# Altium schematic sheet ETH_IFC.SchDoc: Ethernet Interface
size 420 x 297 mm; Author: G.K.; CompanyName: WUT; DrawnBy: G.K.; Organization: WUT ISE; Address1: Warsaw Univeristy of Technology; Address2: Nowowiejska 15/19; DocumentNumber: 2; SheetNumber: 2; SheetTotal: 3; EDA_Number: Sinara; Projet: Booster RF Power Amplifier; ModifiedBy: -; CreateDate: XX/XX/XXXX; CheckedDate: -; Title2: MAC + PHY; DivGrp: ISE; Designer: G.K.; ModifiedDate: -; ProjectName: Booster RF Power Amplifier
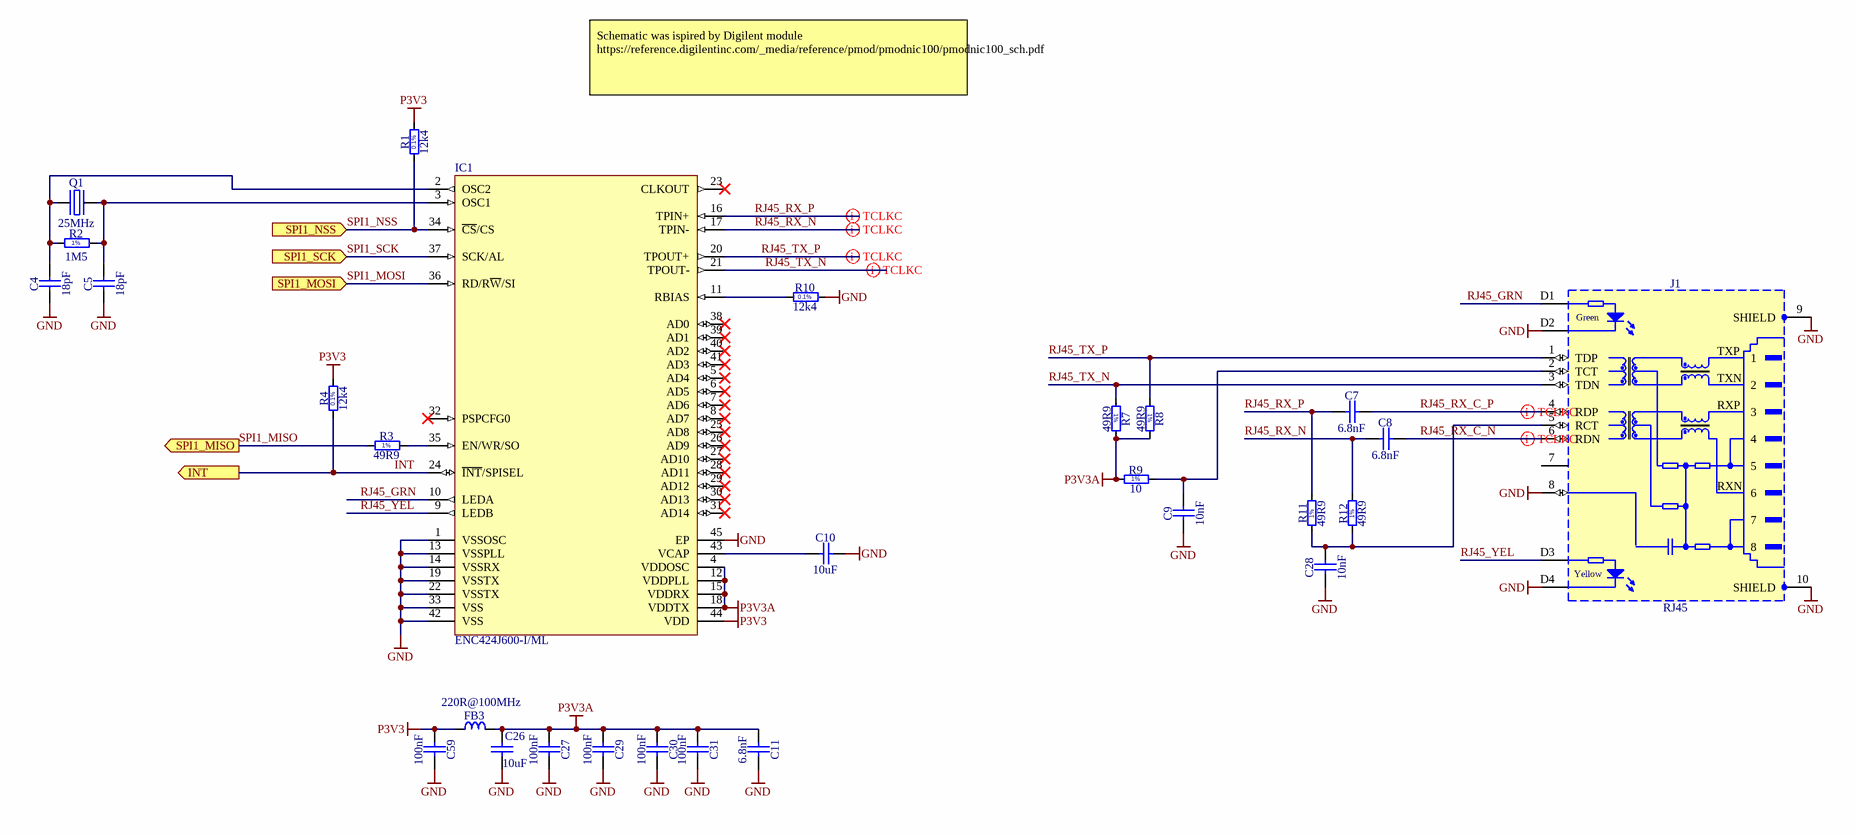
[diagram p0: ETH_IFC.SchDoc]

## Parts
C4  18pF  [CAPC1005X55N]
C5  18pF  [CAPC1005X55N]
C7  6.8nF  [CAPC1608X87N]
C8  6.8nF  [CAPC1608X87N]
C9  10nF  [CAPC1608X87N]
C10  10uF  [CAPC1608X80N]
C11  6.8nF  [CAPC1608X87N]
C26  10uF  [CAPC2012X135N]
C27  100nF  [CAPC1005X55N]
C28  10nF  [CAPC1608X87N]
C29  100nF  [CAPC1005X55N]
C30  100nF  [CAPC1005X55N]
C31  100nF  [CAPC1005X55N]
C59  100nF  [CAPC1005X55N]
FB3  220R@100MHz  [INDC2012X105N]
IC1  ENC424J600-I/ML  [QFN-ML44_M]
J1  RJ45  [TYCO_5-6605308-1]
Q1  25MHz  [XTAL_TXC_AA]
R1  12k4  [RESC1608X55N]
R2  1M5  [RESC1005X40N]
R3  49R9  [RESC1005X40N]
R4  12k4  [RESC1608X55N]
R7  49R9  [RESC1005X40N]
R8  49R9  [RESC1005X40N]
R9  10  [RESC1005X40N]
R10  12k4  [RESC1608X55N]
R11  49R9  [RESC1005X40N]
R12  49R9  [RESC1005X40N]

## Ports
INT (out), SPI1_MISO (out), SPI1_MOSI (in), SPI1_NSS (in), SPI1_SCK (in)

## Nets
GND: C4.1 C5.1 C9.1 C10.2 C11.2 C26.2 C27.2 C28.1 C29.2 C30.2 C31.2 C59.2 IC1.1(VSSOSC) IC1.13(VSSPLL) IC1.14(VSSRX) IC1.19(VSSTX) IC1.22(VSSTX) IC1.33(VSS) IC1.42(VSS) IC1.45(EP) J1.8 J1.9(SHIELD) J1.10(SHIELD) J1.D2 J1.D4 R10.2
P3V3: C59.1 FB3.1 IC1.44(VDD) R1.2 R4.2
P3V3A: C11.1 C26.1 C27.1 C29.1 C30.1 C31.1 FB3.2 IC1.4(VDDOSC) IC1.12(VDDPLL) IC1.15(VDDRX) IC1.18(VDDTX) R7.2 R8.2 R9.1
INT: IC1.24(~{INT}/SPISEL) R4.1 ; port INT
RJ45_GRN: IC1.10(LEDA) J1.D1
RJ45_RX_C_N: C8.2 J1.6(RDN)
RJ45_RX_C_P: C7.2 J1.4(RDP)
RJ45_RX_N: C8.1 IC1.17(TPIN-) R12.2
RJ45_RX_P: C7.1 IC1.16(TPIN+) R11.2
RJ45_TX_N: IC1.21(TPOUT-) J1.3(TDN) R7.1
RJ45_TX_P: IC1.20(TPOUT+) J1.1(TDP) R8.1
RJ45_YEL: IC1.9(LEDB) J1.D3
SPI1_MISO: R3.1 ; port SPI1_MISO
SPI1_MOSI: IC1.36(RD/R~{W}/SI) ; port SPI1_MOSI
SPI1_NSS: IC1.34(~{CS}/CS) R1.1 ; port SPI1_NSS
SPI1_SCK: IC1.37(SCK/AL) ; port SPI1_SCK
NetC4_2: C4.2 IC1.2(OSC2) Q1.1(OSC1) R2.1
NetC5_2: C5.2 IC1.3(OSC1) Q1.2(OSC2) R2.2
NetC9_2: C9.2 J1.2(TCT) R9.2
NetC10_1: C10.1 IC1.43(VCAP)
NetC28_2: C28.2 J1.5(RCT) R11.1 R12.1
NetIC1_11: IC1.11(RBIAS) R10.1
NetIC1_35: IC1.35(EN/WR/SO) R3.2

Not connected (* = marked no-connect by the designer): IC1 5(AD4)* 6(AD5)* 7(AD6)* 8(AD7)* 23(CLKOUT)* 25(AD8)* 26(AD9)* 27(AD10)* 28(AD11)* 29(AD12)* 30(AD13)* 31(AD14)* 32(PSPCFG0)* 38(AD0)* 39(AD1)* 40(AD2)* 41(AD3)*; J1 7

## Layout directives
differential pair: RJ45_RX_C_N, RJ45_RX_C_P, RJ45_RX_N, RJ45_RX_P, RJ45_TX_N, RJ45_TX_P

## Notes on the sheet
- Schematic was ispired by Digilent module https://reference.digilentinc.com/_media/reference/pmod/pmodnic100/pmodnic100_sch.pdf
- Project/Equipment
- Document
- Designer
- Drawn by
- Check.by
- File
- Last Mod.
- Print Date
- Sheet
- Size
- A3
- of
- Rev
- (in symbol R0402_1M5_1%_0.0625W_100PPM) 1%
- (in symbol R0402_10R_1%_0.0625W_200PPM) 1%
- (in symbol R0402_49R9_1%_0.0625W_100PPM) 1%
- (in symbol R0603_12K4_0.1%_0.063W_10PPM) 0.1%
- (in symbol TYCO_5-6605308-1) Green; TXP; TXN; RXP; RXN; Yellow

## Library data of the parts
C4 C5 = CC0402_18PF_50V_5%_C0G: Non-polarised capacitor; Part Description: SMD Multilayer Chip Ceramic Capacitor; Manufacturer: GENERIC; Manufacturer1 Part Number: C0402C180J5GACTU; Voltage: 50V; TC: C0G/NP0; Tolerance: ±5%; Part Number: CC0402_18PF_50V_5%_C0G; Component Kind: Standard; Component Type: Standard; Pin Count: 2; Value: 18pF; Status: Preferred; Manufacturer Part Number: CC0402_18PF_50V_5%_C0G; Case: 0402; Mounted: Yes; Socket: No; SMD: Yes; Manufacturer1 Example: KEMET; Manufacturer1 ComponentHeight: 0.55mm; HelpURL: \\cern.ch\dfs\Applications\Altium\Datasheets\CC0402_C0G_KEMET_(Commercial Grade).pdf; Author: CERN DEM JLC; CreateDate: 04.10.2016; LatestRevisionDate: 04.10.2016; Sense: No
C7 C8 C11 = CC0603_6.8NF_25V_1%_C0G: Non-polarised capacitor; Part Description: SMD Multilayer Chip Ceramic Capacitor; Manufacturer: GENERIC; Manufacturer1 Part Number: C0603C682F3GACTU; Voltage: 25V; TC: C0G/NP0; Tolerance: ±1%; Part Number: CC0603_6.8NF_25V_1%_C0G; Component Kind: Standard; Component Type: Standard; Pin Count: 2; Value: 6.8nF; Status: None; Manufacturer Part Number: CC0603_6.8NF_25V_1%_C0G; Case: 0603; Mounted: Yes; Socket: No; SMD: Yes; Sense: No; Manufacturer1 Example: KEMET; Manufacturer1 ComponentHeight: 0.87mm; HelpURL: \\cern.ch\dfs\Applications\Altium\Datasheets\CC0603_C0G_KEMET_(Commercial Grade).pdf; Author: CERN DEM JLC; CreateDate: 23/05/2018; LatestRevisionDate: 23/05/2018
C9 C28 = CC0603_10NF_50V_5%_C0G: Non-polarised capacitor; Part Description: SMD Multilayer Chip Ceramic Capacitor; Manufacturer: GENERIC; Manufacturer1 Part Number: C1608C0G1H103J080AA; Voltage: 50V; TC: C0G/NP0; Tolerance: ±5%; Part Number: CC0603_10NF_50V_5%_C0G; Component Kind: Standard; Component Type: Standard; Pin Count: 2; Value: 10nF; Status: Preferred; Manufacturer Part Number: CC0603_10NF_50V_5%_C0G; Case: 0603; Mounted: Yes; Socket: No; SMD: Yes; Sense: No; Manufacturer1 Example: TDK; Manufacturer1 ComponentHeight: 0.9mm; HelpURL: \\cern.ch\dfs\Applications\Altium\Datasheets\CC0603_C0G_TDK_C.pdf; Author: CERN DEM JLC; CreateDate: 10.12.2014; LatestRevisionDate: 10.12.2014
C10 = CC0603_10UF_16V_20%_X5R: Non-polarised capacitor; Part Description: SMD Multilayer Chip Ceramic Capacitor; Manufacturer: GENERIC; Manufacturer1 Part Number: GRM188R61C106MA73D; Voltage: 16V; TC: X5R; Tolerance: ±20%; Part Number: CC0603_10UF_16V_20%_X5R; Component Kind: Standard; Component Type: Standard; Pin Count: 2; Value: 10uF; Status: None; Manufacturer Part Number: CC0603_10UF_16V_20%_X5R; Case: 0603; Mounted: Yes; Socket: No; SMD: Yes; Sense: No; Manufacturer1 Example: MURATA; Manufacturer1 ComponentHeight: 0.8mm; HelpURL: \\cern.ch\dfs\Applications\Altium\Datasheets\CC0603_X5R_MURATA_GRM.pdf; Author: CERN DEM MR; CreateDate: 02/03/2016; LatestRevisionDate: 02/03/2016
C26 = CC0805_10UF_10V_10%_X7R: Non-polarised capacitor; Part Description: SMD Multilayer Chip Ceramic Capacitor; Manufacturer: GENERIC; Manufacturer1 Part Number: GRM21BR71A106KE51L; Voltage: 10V; TC: X7R; Tolerance: ±10%; Table: Capacitors SMD; Part Number: CC0805_10UF_10V_10%_X7R; Component Kind: Standard; Component Type: Standard; Pin Count: 2; Value: 10uF; Status: Preferred; Manufacturer Part Number: CC0805_10UF_10V_10%_X7R; Case: 0805; Mounted: Yes; Socket: No; SMD: Yes; Manufacturer1 Example: MURATA; Manufacturer1 ComponentHeight: 1.35mm; HelpURL: \\cern.ch\dfs\Applications\Altium\Datasheets\CC0805_X7R_MURATA.pdf; Author: CERN DEM JLC; CreateDate: 2012-04-30; LatestRevisionDate: 2012-04-30
C27 C29-C31 C59 = CC0402_100NF_16V_10%_X7R: Non-polarised capacitor; Part Description: SMD Multilayer Chip Ceramic Capacitor; Manufacturer: GENERIC; Manufacturer1 Part Number: GRM155R71C104KA88D; Voltage: 16V; TC: X7R; Tolerance: ±10%; Part Number: CC0402_100NF_16V_10%_X7R; Component Kind: Standard; Component Type: Standard; Pin Count: 2; Value: 100nF; Status: Not Recommended; Manufacturer Part Number: CC0402_100NF_16V_10%_X7R; Case: 0402; Mounted: Yes; Socket: No; SMD: Yes; Manufacturer1 Example: MURATA; Manufacturer1 ComponentHeight: 0.55mm; HelpURL: \\cern.ch\dfs\Applications\Altium\Datasheets\CC0402_X7R_MURATA_GRM.pdf; Author: CERN DEM JLC; CreateDate: 05.12.2013; LatestRevisionDate: 03.12.2007; Sense: No
FB3 = IND0805_MURATA_BLM21PG221SN1D: Inductor; Part Description: SMD EMIFIL Suppression Chip Ferrite Bead; Manufacturer: MURATA; Power: 2A; Resistance: 0.05R; Tolerance: ±25%; Table: Inductors SMD; Part Number: IND0805_MURATA_BLM21PG221SN1D; Component Kind: Standard; Component Type: Standard; Pin Count: 2; Value: 220R@100MHz; Status: None; Manufacturer Part Number: BLM21PG221SN1D; Case: 0805; Mounted: Yes; Socket: No; SMD: Yes; ComponentHeight: 1.05mm; HelpURL: \\cern.ch\dfs\Applications\Altium\Datasheets\IND0402_MURATA_BLM21P.pdf; Author: CERN DEM JLC; CreateDate: 2010-01-25; LatestRevisionDate: 2010-01-25
IC1 = CMP-0186-00117-2: Stand-Alone 10/100 Ethernet Controller with SPI or Parallel Interface, 44-Pin QFN, Industrial Temperature; Code_IPC: QFN65P800X800-44V2; ComponentLink2Description: Datasheet; PackageReference: QFN-ML44; ComponentLink2URL: http://ww1.microchip.com/downloads/en/DeviceDoc/39935c.pdf; ComponentLink3URL: http://www.microchip.com/stellent/groups/techpub_sg/documents/packagingspec/en012702.pdf; RevisionNote: URLs added. DatasheetVersion updated. Sch updated.; Code_JEDEC: MO-220; ComponentLink1URL: http://www.microchip.com/; PackageDescription: 44-Lead Plastic Quad Flat, No Lead Package (ML) - 8x8 mm Body [QFN]; ComponentLink1Description: Manufacturer URL; DatasheetVersion: revC, Jan-2010; ComponentLink3Description: Package Specification; PackageVersion: revBB, Aug-2009; Manufacturer Part Number: ENC424J600-I/ML
J1 = TYCO_5-6605308-1: 1 Port, Yellow/Green LEDs, RJ45 10/100Base-T Ethernet, Mag45 Connector Module With Integrated Magnetics; Manufacturer: TYCO ELECTRONICS; PressFit: No; Part Number: TYCO_5-6605308-1; Component Kind: Standard; Component Type: Standard; Pin Count: 14; Family: RJ45; Mounted: Yes; Socket: No; SMD: No; Sense: No; Status: None; Part Description: 1 Port, Yellow/Green LEDs, RJ45 10/100Base-T Ethernet, Mag45 Connector Module With Integrated Magnetics; Manufacturer Part Number: 5-6605308-1; ComponentHeight: 15.24mm; HelpURL: \\cern.ch\dfs\Applications\Altium\Datasheets\TYCO_5-6605308-1.pdf; Author: CERN DEM JLC; CreateDate: 23.08.2012; LatestRevisionDate: 23.08.2012
Q1 = XTAL_25MHZ_TXC_AA-25.000MALE-T: Quartz Crystal; Part Description: Tolerance: ± 30ppm, Stability: ±50ppm, -40°C to +85°C, 8pF, SMD Glass Sealing Crystal, AA Series; Manufacturer: TXC CORPORATION; PressFit: No; Bonding: No; Part Number: XTAL_25MHZ_TXC_AA-25.000MALE-T; Component Kind: Standard; Component Type: Standard; PackageDescription: SMD Glass Seam Sealing Crystal, 2 Pins, 3.20mm L X 5.00mm W, AA Serie; Value: 25MHz; Manufacturer Part Number: AA-25.000MALE-T; Pin Count: 2; Mounted: Yes; Socket: No; SMD: Yes; Sense: No; ComponentHeight: 1.2mm; HelpURL: \\cern.ch\dfs\Applications\Altium\Datasheets\XTAL_TXC_AA.pdf; Author: GK; CreateDate: 28.08.2018; LatestRevisionDate: 28.08.2018
R1 R4 R10 = R0603_12K4_0.1%_0.063W_10PPM: Resistor - 0.1%; Part Description: Thin Film Chip Resistor; Manufacturer: GENERIC; Manufacturer1 Part Number: RN73C1J12K4BTDF; Power: 0.063W; TC: ±10ppm; Part Number: R0603_12K4_0.1%_0.063W_10PPM; Component Kind: Standard; Component Type: Standard; Pin Count: 2; Value: 12k4; Status: Not recommended; Tolerance: ±0.1%; Manufacturer Part Number: R0603_12K4_0.1%_0.063W_10PPM; Case: 0603; Mounted: Yes; Sense: No; Socket: No; SMD: Yes; Manufacturer1 Example: TYCO HOLSWORTHY; Manufacturer1 ComponentHeight: 0.5mm; HelpURL: \\cern.ch\dfs\Applications\Altium\Datasheets\R0603_Tyco_RN73.pdf; Author: CERN DEM JLC; CreateDate: 03.12.2007; LatestRevisionDate: 13.03.2008
R2 = R0402_1M5_1%_0.0625W_100PPM: Resistor - 1%; Part Description: General Purpose Thick Film Chip Resistor; Manufacturer: GENERIC; Manufacturer1 Part Number: 232270671505L; TC: ±100ppm/°C; PressFit: No; Part Number: R0402_1M5_1%_0.0625W_100PPM; Component Kind: Standard; Component Type: Standard; Pin Count: 2; Value: 1M5; Status: Not Recommended; Power: 0.0625W; Tolerance: ±1%; Manufacturer Part Number: R0402_1M5_1%_0.0625W_100PPM; Case: 0402; Mounted: Yes; Sense: No; Socket: No; SMD: Yes; Manufacturer1 Example: YAGEO PHYCOMP; Manufacturer1 ComponentHeight: 0.4mm; HelpURL: \\cern.ch\dfs\Applications\Altium\Datasheets\R0402_Phycomp_RC0402.pdf; Author: CERN DEM JLC; CreateDate: 03/12/2007; LatestRevisionDate: 17/10/2012
R3 R7 R8 R11 R12 = R0402_49R9_1%_0.0625W_100PPM: Resistor - 1%; Part Description: General Purpose Thick Film Chip Resistor; Manufacturer: GENERIC; Manufacturer1 Part Number: 232270674999L or RC0402FR-0749R9L; TC: ±100ppm/°C; Table: Resistors SMD; Part Number: R0402_49R9_1%_0.0625W_100PPM; Component Kind: Standard; Component Type: Standard; Pin Count: 2; Value: 49R9; Status: Not recommended; Power: 0.0625W; Tolerance: ±1%; Manufacturer Part Number: R0402_49R9_1%_0.0625W_100PPM; Case: 0402; Mounted: Yes; Socket: No; SMD: Yes; Manufacturer1 Example: YAGEO PHYCOMP; Manufacturer1 ComponentHeight: 0.4mm; HelpURL: \\cern.ch\dfs\Applications\Altium\Datasheets\R0402_Phycomp_RC0402.pdf; Author: CERN DEM JLC; CreateDate: 2012-10-24; LatestRevisionDate: 2012-10-24
R9 = R0402_10R_1%_0.0625W_200PPM: Resistor - 1%; Part Description: General Purpose Thick Film Chip Resistor; Manufacturer: GENERIC; Manufacturer1 Part Number: 232270671009L; TC: ±200ppm/°C; Part Number: R0402_10R_1%_0.0625W_200PPM; Component Kind: Standard; Component Type: Standard; Pin Count: 2; Value: 10; Status: Not recommended; Power: 0.0625W; Tolerance: ±1%; Manufacturer Part Number: R0402_10R_1%_0.0625W_200PPM; Case: 0402; Mounted: Yes; Sense: No; Socket: No; SMD: Yes; Manufacturer1 Example: YAGEO PHYCOMP; Manufacturer1 ComponentHeight: 0.4mm; HelpURL: \\cern.ch\dfs\Applications\Altium\Datasheets\R0402_Phycomp_RC0402.pdf; Author: CERN DEM JLC; CreateDate: 24.06.2009; LatestRevisionDate: 17.10.2012